# Altium schematic sheet ScopePower.SchDoc: 1KV Power Supply
size Letter; Organization: ES; Revision: A; SheetNumber: 1; SheetTotal: 1
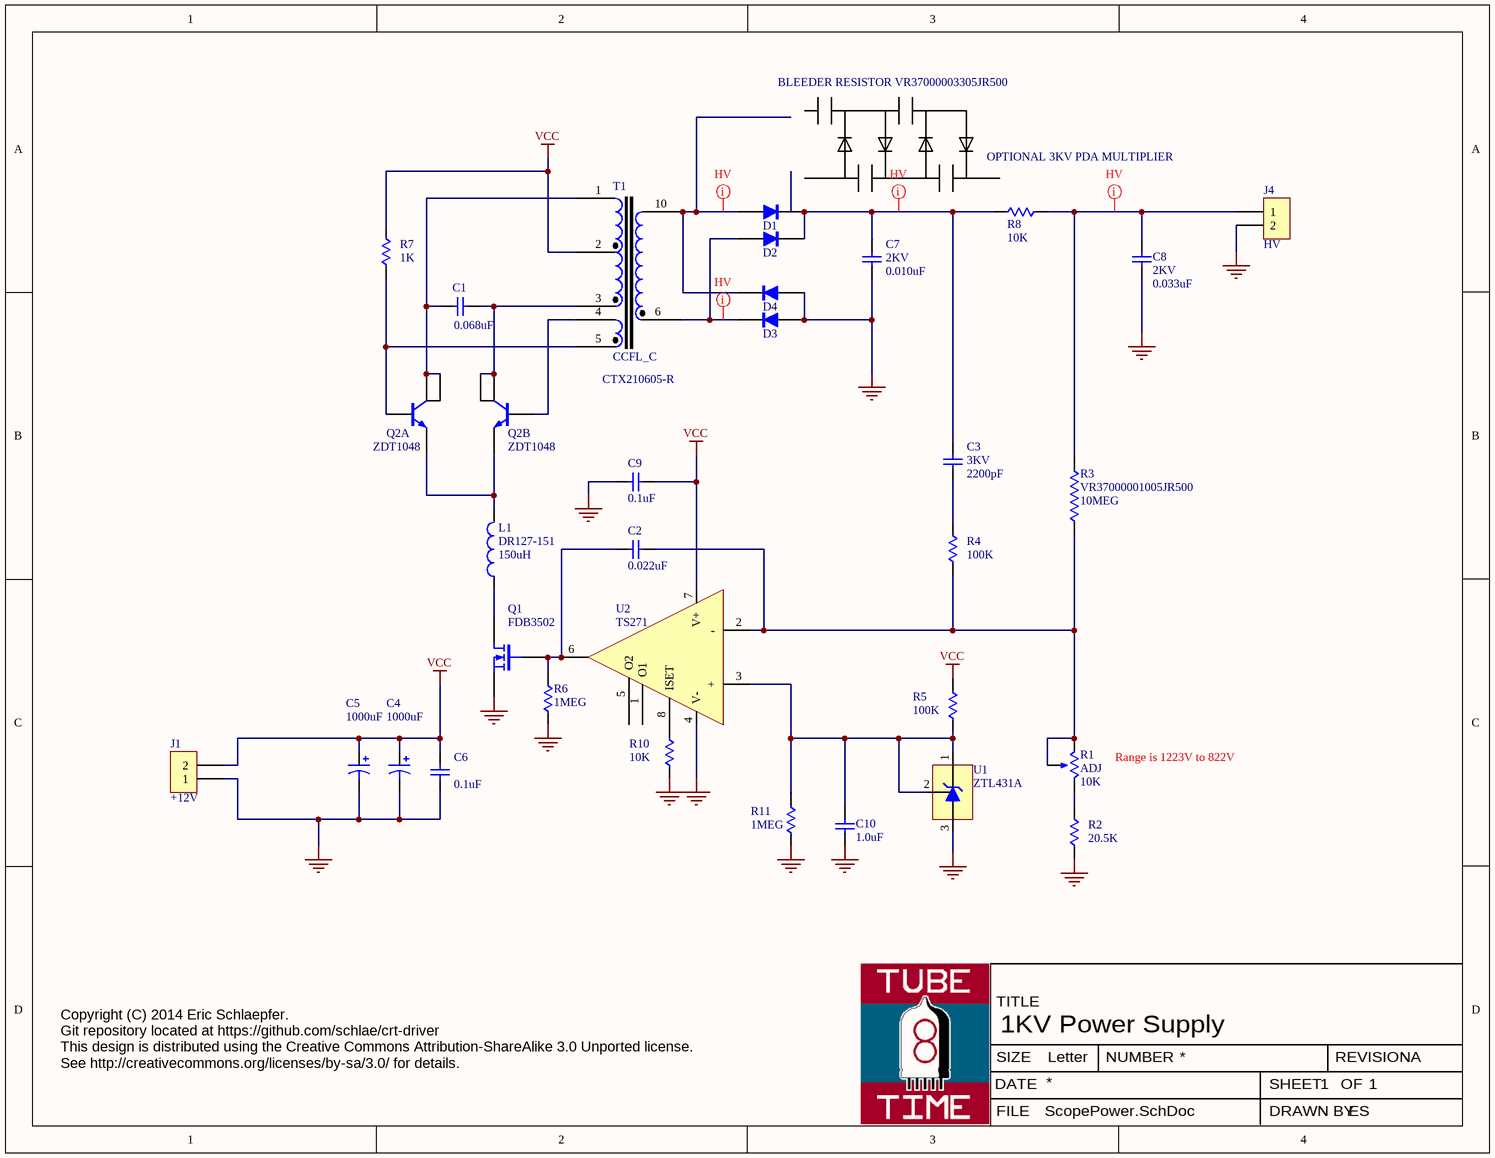
[diagram p0: ScopePower.SchDoc]

## Parts
C1  value 0.068uF  [WIMAMKP2]  (hidden comment: Cap)
C2  value 0.022uF  [G_0805[2012]]
C3  3KV  value 2200pF  [CAP250X100]
C4  value 1000uF  [CAP_R200x400]  (hidden comment: Cap Pol2)
C5  value 1000uF  [CAP_R200x400]  (hidden comment: Cap Pol2)
C6  value 0.1uF  [G_0805[2012]]
C7  2KV  value 0.010uF  [CAP400X100]
C8  2KV  value 0.033uF  [CAP400X100]
C9  value 0.1uF  [G_0805[2012]]
C10  value 1.0uF  [G_0805[2012]]  (hidden comment: Cap)
D1  Diode  [DIODE400X100]  (value not drawn)
D2  Diode  [DIODE400X100]  (value not drawn)
D3  Diode  [DIODE400X100]  (value not drawn)
D4  Diode  [DIODE400X100]  (value not drawn)
J1  +12V  [HDR2S156]
J4  HV  [HDR3S156M1]
L1  DR127-151  value 150uH  [DR124]
Q1  FDB3502  [G_TO252M[D2PAK]]
Q2  ZDT1048  [G_SOT223-8]  (parts A,B of 2)
R1  ADJ  value 10K  [POT_TRIM BOURNS 3386F]
R2  value 20.5K  [G_0805[2012]]  (hidden comment: Res1)
R3  VR37000001005JR500  value 10MEG  [RES500X160]
R4  value 100K  [G_1206[3216]]  (hidden comment: *)
R5  value 100K  [G_0805[2012]]
R6  value 1MEG  [G_0805[2012]]
R7  value 1K  [G_0805[2012]]  (hidden comment: Res1)
R8  value 10K  [G_1206[3216]]  (hidden comment: Res1)
R10  value 10K  [G_0805[2012]]
R11  value 1MEG  [G_0805[2012]]
T1  CCFL_C  ManufPart: CTX210605-R  [CTX2106xx]
U1  ZTL431A  [G_SOT23]
U2  TS271  [G_SO8]

## Nets
GND: C4.2 C5.2 C6.2 C7.1 C8.2 C9.2 C10.1 D3.A D4.A J1.1 J4.2 Q1.S R2.1 R6.2 R10.2 R11.2 U1.3(A) U2.4(V-)
VCC: C4.1 C5.1 C6.1 C9.1 J1.2 R5.1 R7.2 T1.2 U2.7(V+)
NetC1_1: C1.1 Q2.5(C) Q2.6(C) T1.1
NetC1_2: C1.2 Q2.7(C) Q2.8(C) T1.3
NetC2_1: C2.1 R1.2(BOT) R1.3(TAP) R3.1 R4.1 U2.2(-)
NetC2_2: C2.2 Q1.G R6.1 U2.6(OUT)
NetC3_1: C3.1 R4.2
NetC3_2: C3.2 C7.2 D1.K D2.K R8.1
NetC8_1: C8.1 J4.1 R3.2 R8.2
NetC10_2: C10.2 R5.2 R11.1 U1.1(C) U1.2(REF) U2.3(+)
NetD1_A: D1.A D4.K T1.10
NetD2_A: D2.A D3.K T1.6
NetL1_1: L1.1 Q1.D
NetL1_2: L1.2 Q2.1(E) Q2.3(E)
NetQ2_2: Q2.2(B) T1.4
NetQ2_4: Q2.4(B) R7.1 T1.5
NetR1_1: R1.1(TOP) R2.2
NetR10_1: R10.1 U2.8(ISET)

Not connected (* = marked no-connect by the designer): U2 1(O1) 5(O2)

## Layout directives
net class HV: NetC3_2, NetC8_1, NetD1_A, NetD2_A

## Notes on the sheet
- BLEEDER RESISTOR VR37000003305JR500
- (near R8) OPTIONAL 3KV PDA MULTIPLIER
- (near R1) Range is 1223V to 822V
- Copyright (C) 2014 Eric Schlaepfer.
  Git repository located at https://github.com/schlae/crt-driver
  This design is distributed using the Creative Commons Attribution-ShareAlike 3.0 Unported license.
  See http://creativecommons.org/licenses/by-sa/3.0/ for details.
- TITLE
- DATE
- SIZE
- Letter
- NUMBER
- SHEET
- REVISION
- OF
- FILE
- DRAWN BY

## Library data of the parts
C1 = Cap: Capacitor; ManufPart: MKP2D026801E00JSSD; Mouser: 505-MKP20.068/100/5
C2 C6 C9 = Cap: Capacitor
  C2: Mouser: 810-C2012C0G1H223J
  C6 C9: Mouser: 810-C2012X8R1H104K
C3 = Cap: Capacitor; ManufPart: 564R30GAD22; Mouser: 75-564R30GAD22
C4 C5 = CapP: Polarized Capacitor; ManufPart: UVR1E102MPD; Mouser: 647-UVR1E102MPD
C7 = Cap: Capacitor; ManufPart: 564R20GASS10; Mouser: 75-564R20GASS10
C8 = Cap: Capacitor; ManufPart: 565R30GASS33; Mouser: 75-565R30GASS33
C10 = Cap: Capacitor; ManufPart: C2012X7R1E105K125AB; Mouser: 810-C2012X7R1E105K
D1-D4 = Diode: ManufPart: rgp02-20e; Mouser: 625-RGP02-20E-E3
J1 J4 = CON2: Connector, 2 pin
  J1: Mouser: 538-26-48-1021
  J4: Mouser: 538-26-48-1031
L1 = Inductor: ManufPart: DR127-151-R; Mouser: 704-DR127-151-R
Q1 = MOSFET-N: N-Channel MOSFET; ManufPart: FDB3502; Mouser: 512-FDB3502
Q2 = NPN_DUAL: NPN Dual Bipolar Transistor; ManufPart: ZDT1048TA; Mouser: 522-ZDT1048TA
R1 = Pot: Variable Resistor; ManufPart: 3386F-1-103LF; Mouser: 652-3386F-1-103LF
R2 = Res: Resistor; ManufPart: CRCW080520K5FKEA; Mouser: 71-CRCW0805-20.5K-E3
R3 = ResSpecial: Resistor, Special Property; Manuf: Vishay/BC; ManufPart: VR37000001005JR500; Mouser: 594-5053DM10M00JT
R4 = Res: Resistor; ManufPart: CRCW1206100KFKEA; Mouser: 71-CRCW1206-100K-E3
R5 = Res: Resistor; ManufPart: CRCW0805100KFKEA; Mouser: 71-CRCW0805-100K-E3
R6 R11 = Res: Resistor; ManufPart: CRCW08051M00FKEA; Mouser: 71-CRCW0805-1.0M-E3
R7 = Res: Resistor; ManufPart: CRCW08051K00JNEA; Mouser: 71-CRCW0805J-1K-E3
R8 = Res: Resistor; ManufPart: CRCW120610K0FKEA; Mouser: 71-CRCW1206-10K-E3
R10 = Res: Resistor; ManufPart: CRCW080510K0FKTA; Mouser: 71-CRCW0805-10K
T1 = CCFL_C: CCFL Transformer; Mouser: 704-CTX210605-R
U1 = TL431: Adjustable Shunt Reg; ManufPart: ZTL431A; Mouser: 522-ZTL431AFTA
U2 = OpAmpSingle: Generic Single Op Amp; ManufPart: TS271IDT; Mouser: 511-TS271IDT